# Altium schematic sheet VHDCI_CON.SchDoc: Metlino
size 420 x 297 mm; CheckedBy: P.Kulik,T.Przywozki,W.Ruclo; Author: G.Kasprowicz; CompanyName: WUT ISE; DrawnBy: G.Kasprowicz; Organization: WUT ISE; Address1: PW ISE; Address2: Nowowiejska 15/19 00-665 Warsaw; Address3: gkasprow@gmail.com; DocumentNumber: 14; Revision: 2; SheetNumber: 14; SheetTotal: 29; ModifiedBy: -; CheckedDate: -; Title2: VHDCI connectors; DivGrp: WUT ISE; Designer: G.Kasprowicz; ModifiedDate: -; ProjectName: Sensor Box
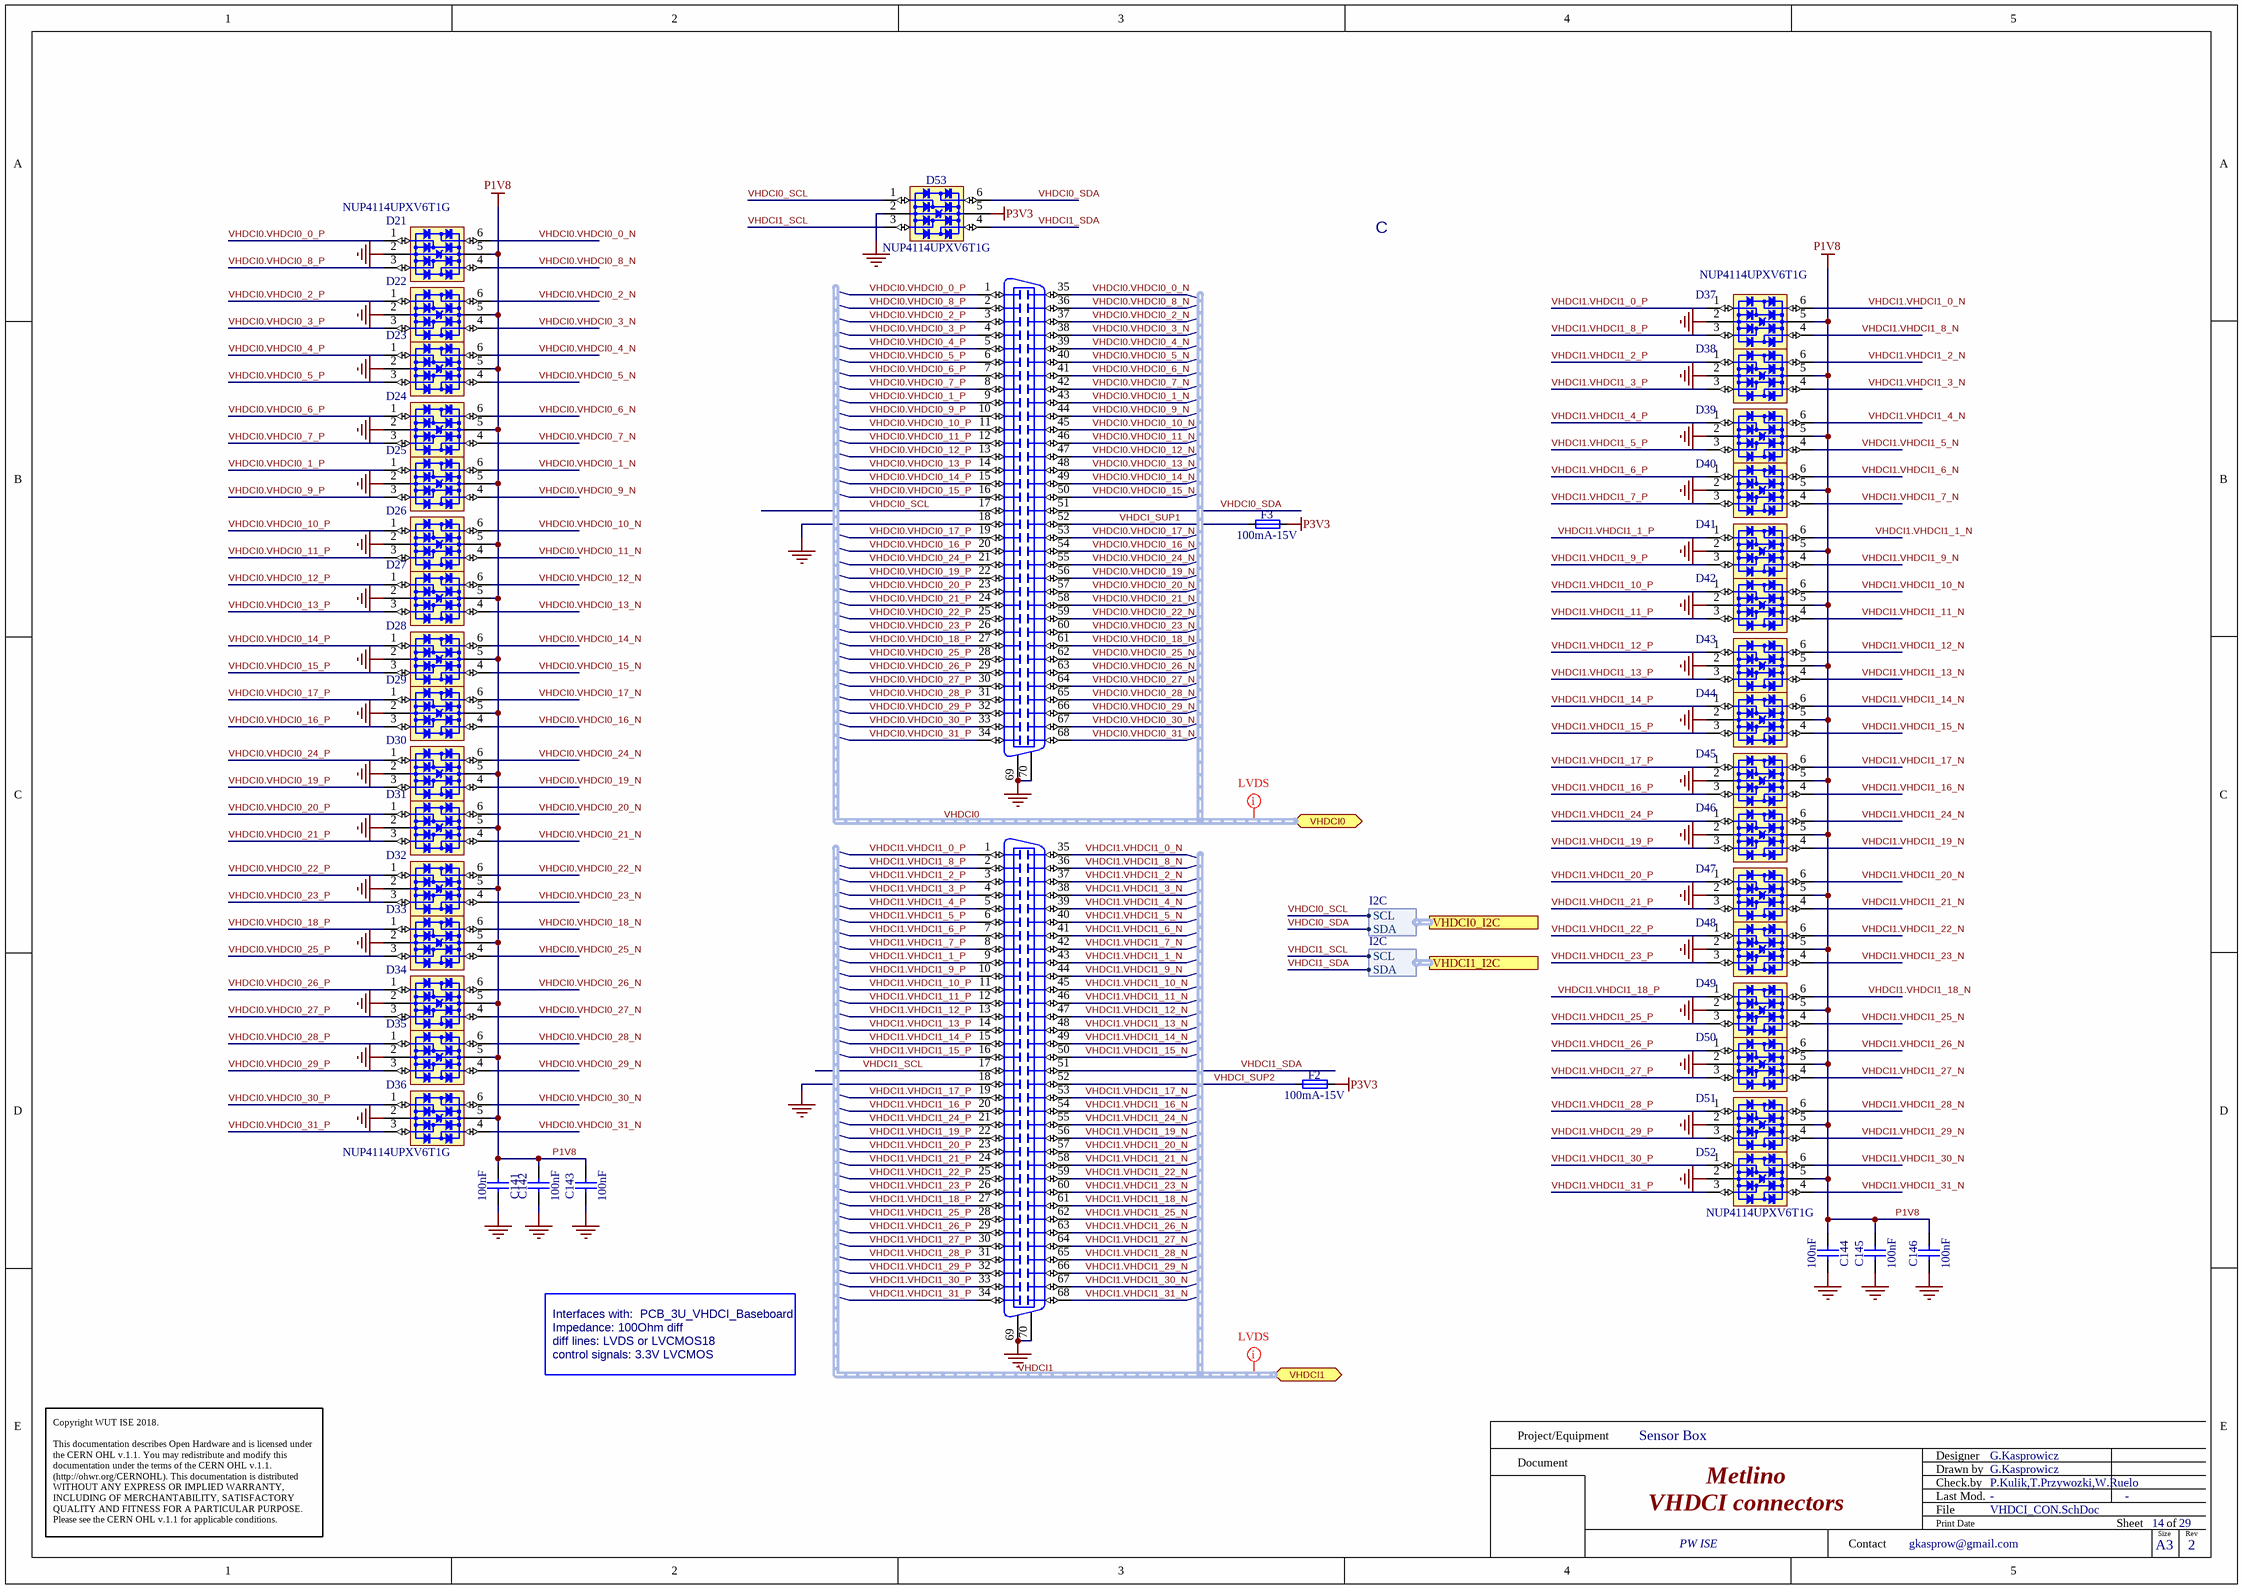
[diagram p0: VHDCI_CON.SchDoc]

## Parts
C141  100nF  [CAPC0603X33N]
C142  100nF  [CAPC0603X33N]
C143  100nF  [CAPC0603X33N]
C144  100nF  [CAPC0603X33N]
C145  100nF  [CAPC0603X33N]
C146  100nF  [CAPC0603X33N]
D21  NUP4114UPXV6T1G  [SOTFL50P160X60-6N]
D22  NUP4114UPXV6T1G  [SOTFL50P160X60-6N]  (value not drawn)
D23  NUP4114UPXV6T1G  [SOTFL50P160X60-6N]  (value not drawn)
D24  NUP4114UPXV6T1G  [SOTFL50P160X60-6N]  (value not drawn)
D25  NUP4114UPXV6T1G  [SOTFL50P160X60-6N]  (value not drawn)
D26  NUP4114UPXV6T1G  [SOTFL50P160X60-6N]  (value not drawn)
D27  NUP4114UPXV6T1G  [SOTFL50P160X60-6N]  (value not drawn)
D28  NUP4114UPXV6T1G  [SOTFL50P160X60-6N]  (value not drawn)
D29  NUP4114UPXV6T1G  [SOTFL50P160X60-6N]  (value not drawn)
D30  NUP4114UPXV6T1G  [SOTFL50P160X60-6N]  (value not drawn)
D31  NUP4114UPXV6T1G  [SOTFL50P160X60-6N]  (value not drawn)
D32  NUP4114UPXV6T1G  [SOTFL50P160X60-6N]  (value not drawn)
D33  NUP4114UPXV6T1G  [SOTFL50P160X60-6N]  (value not drawn)
D34  NUP4114UPXV6T1G  [SOTFL50P160X60-6N]  (value not drawn)
D35  NUP4114UPXV6T1G  [SOTFL50P160X60-6N]  (value not drawn)
D36  NUP4114UPXV6T1G  [SOTFL50P160X60-6N]
D37  NUP4114UPXV6T1G  [SOTFL50P160X60-6N]
D38  NUP4114UPXV6T1G  [SOTFL50P160X60-6N]  (value not drawn)
D39  NUP4114UPXV6T1G  [SOTFL50P160X60-6N]  (value not drawn)
D40  NUP4114UPXV6T1G  [SOTFL50P160X60-6N]  (value not drawn)
D41  NUP4114UPXV6T1G  [SOTFL50P160X60-6N]  (value not drawn)
D42  NUP4114UPXV6T1G  [SOTFL50P160X60-6N]  (value not drawn)
D43  NUP4114UPXV6T1G  [SOTFL50P160X60-6N]  (value not drawn)
D44  NUP4114UPXV6T1G  [SOTFL50P160X60-6N]  (value not drawn)
D45  NUP4114UPXV6T1G  [SOTFL50P160X60-6N]  (value not drawn)
D46  NUP4114UPXV6T1G  [SOTFL50P160X60-6N]  (value not drawn)
D47  NUP4114UPXV6T1G  [SOTFL50P160X60-6N]  (value not drawn)
D48  NUP4114UPXV6T1G  [SOTFL50P160X60-6N]  (value not drawn)
D49  NUP4114UPXV6T1G  [SOTFL50P160X60-6N]  (value not drawn)
D50  NUP4114UPXV6T1G  [SOTFL50P160X60-6N]  (value not drawn)
D51  NUP4114UPXV6T1G  [SOTFL50P160X60-6N]  (value not drawn)
D52  NUP4114UPXV6T1G  [SOTFL50P160X60-6N]
D53  NUP4114UPXV6T1G  [SOTFL50P160X60-6N]
F2  100mA-15V  [FUSR_LITTELFUSE_0805L010]
F3  100mA-15V  [FUSR_LITTELFUSE_0805L010]
J14  VHDCI  [MOLEX_71430-0013]  (value not drawn)
J15  VHDCI  [MOLEX_71430-0013]  (value not drawn)

## Ports
VHDCI0 (bidir, harness VHDCI0), VHDCI0_I2C (harness I2C), VHDCI1 (bidir, harness VHDCI1), VHDCI1_I2C (harness I2C)

## Harnesses
I2C: SCL, SDA

## Nets
GND: C141.1 C142.1 C143.1 C144.1 C145.1 C146.1 D21.2(GND) D22.2(GND) D23.2(GND) D24.2(GND) D25.2(GND) D26.2(GND) D27.2(GND) D28.2(GND) D29.2(GND) D30.2(GND) D31.2(GND) D32.2(GND) D33.2(GND) D34.2(GND) D35.2(GND) D36.2(GND) D37.2(GND) D38.2(GND) D39.2(GND) D40.2(GND) D41.2(GND) D42.2(GND) D43.2(GND) D44.2(GND) D45.2(GND) D46.2(GND) D47.2(GND) D48.2(GND) D49.2(GND) D50.2(GND) D51.2(GND) D52.2(GND) D53.2(GND) J14.18 J14.69 J14.70 J15.18 J15.69 J15.70
P1V8: C141.2 C142.2 C143.2 C144.2 C145.2 C146.2 D21.5(VBUS) D22.5(VBUS) D23.5(VBUS) D24.5(VBUS) D25.5(VBUS) D26.5(VBUS) D27.5(VBUS) D28.5(VBUS) D29.5(VBUS) D30.5(VBUS) D31.5(VBUS) D32.5(VBUS) D33.5(VBUS) D34.5(VBUS) D35.5(VBUS) D36.5(VBUS) D37.5(VBUS) D38.5(VBUS) D39.5(VBUS) D40.5(VBUS) D41.5(VBUS) D42.5(VBUS) D43.5(VBUS) D44.5(VBUS) D45.5(VBUS) D46.5(VBUS) D47.5(VBUS) D48.5(VBUS) D49.5(VBUS) D50.5(VBUS) D51.5(VBUS) D52.5(VBUS)
P3V3: D53.5(VBUS) F2.2 F3.2
VHDCI0.VHDCI0_0_N: D21.6(I/O4) J14.35
VHDCI0.VHDCI0_0_P: D21.1(I/O1) J14.1
VHDCI0.VHDCI0_1_N: D25.6(I/O4) J14.43
VHDCI0.VHDCI0_1_P: D25.1(I/O1) J14.9
VHDCI0.VHDCI0_2_N: D22.6(I/O4) J14.37
VHDCI0.VHDCI0_2_P: D22.1(I/O1) J14.3
VHDCI0.VHDCI0_3_N: D22.4(I/O3) J14.38
VHDCI0.VHDCI0_3_P: D22.3(I/O2) J14.4
VHDCI0.VHDCI0_4_N: D23.6(I/O4) J14.39
VHDCI0.VHDCI0_4_P: D23.1(I/O1) J14.5
VHDCI0.VHDCI0_5_N: D23.4(I/O3) J14.40
VHDCI0.VHDCI0_5_P: D23.3(I/O2) J14.6
VHDCI0.VHDCI0_6_N: D24.6(I/O4) J14.41
VHDCI0.VHDCI0_6_P: D24.1(I/O1) J14.7
VHDCI0.VHDCI0_7_N: D24.4(I/O3) J14.42
VHDCI0.VHDCI0_7_P: D24.3(I/O2) J14.8
VHDCI0.VHDCI0_8_N: D21.4(I/O3) J14.36
VHDCI0.VHDCI0_8_P: D21.3(I/O2) J14.2
VHDCI0.VHDCI0_9_N: D25.4(I/O3) J14.44
VHDCI0.VHDCI0_9_P: D25.3(I/O2) J14.10
VHDCI0.VHDCI0_10_N: D26.6(I/O4) J14.45
VHDCI0.VHDCI0_10_P: D26.1(I/O1) J14.11
VHDCI0.VHDCI0_11_N: D26.4(I/O3) J14.46
VHDCI0.VHDCI0_11_P: D26.3(I/O2) J14.12
VHDCI0.VHDCI0_12_N: D27.6(I/O4) J14.47
VHDCI0.VHDCI0_12_P: D27.1(I/O1) J14.13
VHDCI0.VHDCI0_13_N: D27.4(I/O3) J14.48
VHDCI0.VHDCI0_13_P: D27.3(I/O2) J14.14
VHDCI0.VHDCI0_14_N: D28.6(I/O4) J14.49
VHDCI0.VHDCI0_14_P: D28.1(I/O1) J14.15
VHDCI0.VHDCI0_15_N: D28.4(I/O3) J14.50
VHDCI0.VHDCI0_15_P: D28.3(I/O2) J14.16
VHDCI0.VHDCI0_16_N: D29.4(I/O3) J14.54
VHDCI0.VHDCI0_16_P: D29.3(I/O2) J14.20
VHDCI0.VHDCI0_17_N: D29.6(I/O4) J14.53
VHDCI0.VHDCI0_17_P: D29.1(I/O1) J14.19
VHDCI0.VHDCI0_18_N: D33.6(I/O4) J14.61
VHDCI0.VHDCI0_18_P: D33.1(I/O1) J14.27
VHDCI0.VHDCI0_19_N: D30.4(I/O3) J14.56
VHDCI0.VHDCI0_19_P: D30.3(I/O2) J14.22
VHDCI0.VHDCI0_20_N: D31.6(I/O4) J14.57
VHDCI0.VHDCI0_20_P: D31.1(I/O1) J14.23
VHDCI0.VHDCI0_21_N: D31.4(I/O3) J14.58
VHDCI0.VHDCI0_21_P: D31.3(I/O2) J14.24
VHDCI0.VHDCI0_22_N: D32.6(I/O4) J14.59
VHDCI0.VHDCI0_22_P: D32.1(I/O1) J14.25
VHDCI0.VHDCI0_23_N: D32.4(I/O3) J14.60
VHDCI0.VHDCI0_23_P: D32.3(I/O2) J14.26
VHDCI0.VHDCI0_24_N: D30.6(I/O4) J14.55
VHDCI0.VHDCI0_24_P: D30.1(I/O1) J14.21
VHDCI0.VHDCI0_25_N: D33.4(I/O3) J14.62
VHDCI0.VHDCI0_25_P: D33.3(I/O2) J14.28
VHDCI0.VHDCI0_26_N: D34.6(I/O4) J14.63
VHDCI0.VHDCI0_26_P: D34.1(I/O1) J14.29
VHDCI0.VHDCI0_27_N: D34.4(I/O3) J14.64
VHDCI0.VHDCI0_27_P: D34.3(I/O2) J14.30
VHDCI0.VHDCI0_28_N: D35.6(I/O4) J14.65
VHDCI0.VHDCI0_28_P: D35.1(I/O1) J14.31
VHDCI0.VHDCI0_29_N: D35.4(I/O3) J14.66
VHDCI0.VHDCI0_29_P: D35.3(I/O2) J14.32
VHDCI0.VHDCI0_30_N: D36.6(I/O4) J14.67
VHDCI0.VHDCI0_30_P: D36.1(I/O1) J14.33
VHDCI0.VHDCI0_31_N: D36.4(I/O3) J14.68
VHDCI0.VHDCI0_31_P: D36.3(I/O2) J14.34
VHDCI0_SCL: D53.1(I/O1) J14.17 ; port VHDCI0_I2C.SCL
VHDCI0_SDA: D53.6(I/O4) J14.51 ; port VHDCI0_I2C.SDA
VHDCI1.VHDCI1_0_N: D37.6(I/O4) J15.35
VHDCI1.VHDCI1_0_P: D37.1(I/O1) J15.1
VHDCI1.VHDCI1_1_N: D41.6(I/O4) J15.43
VHDCI1.VHDCI1_1_P: D41.1(I/O1) J15.9
VHDCI1.VHDCI1_2_N: D38.6(I/O4) J15.37
VHDCI1.VHDCI1_2_P: D38.1(I/O1) J15.3
VHDCI1.VHDCI1_3_N: D38.4(I/O3) J15.38
VHDCI1.VHDCI1_3_P: D38.3(I/O2) J15.4
VHDCI1.VHDCI1_4_N: D39.6(I/O4) J15.39
VHDCI1.VHDCI1_4_P: D39.1(I/O1) J15.5
VHDCI1.VHDCI1_5_N: D39.4(I/O3) J15.40
VHDCI1.VHDCI1_5_P: D39.3(I/O2) J15.6
VHDCI1.VHDCI1_6_N: D40.6(I/O4) J15.41
VHDCI1.VHDCI1_6_P: D40.1(I/O1) J15.7
VHDCI1.VHDCI1_7_N: D40.4(I/O3) J15.42
VHDCI1.VHDCI1_7_P: D40.3(I/O2) J15.8
VHDCI1.VHDCI1_8_N: D37.4(I/O3) J15.36
VHDCI1.VHDCI1_8_P: D37.3(I/O2) J15.2
VHDCI1.VHDCI1_9_N: D41.4(I/O3) J15.44
VHDCI1.VHDCI1_9_P: D41.3(I/O2) J15.10
VHDCI1.VHDCI1_10_N: D42.6(I/O4) J15.45
VHDCI1.VHDCI1_10_P: D42.1(I/O1) J15.11
VHDCI1.VHDCI1_11_N: D42.4(I/O3) J15.46
VHDCI1.VHDCI1_11_P: D42.3(I/O2) J15.12
VHDCI1.VHDCI1_12_N: D43.6(I/O4) J15.47
VHDCI1.VHDCI1_12_P: D43.1(I/O1) J15.13
VHDCI1.VHDCI1_13_N: D43.4(I/O3) J15.48
VHDCI1.VHDCI1_13_P: D43.3(I/O2) J15.14
VHDCI1.VHDCI1_14_N: D44.6(I/O4) J15.49
VHDCI1.VHDCI1_14_P: D44.1(I/O1) J15.15
VHDCI1.VHDCI1_15_N: D44.4(I/O3) J15.50
VHDCI1.VHDCI1_15_P: D44.3(I/O2) J15.16
VHDCI1.VHDCI1_16_N: D45.4(I/O3) J15.54
VHDCI1.VHDCI1_16_P: D45.3(I/O2) J15.20
VHDCI1.VHDCI1_17_N: D45.6(I/O4) J15.53
VHDCI1.VHDCI1_17_P: D45.1(I/O1) J15.19
VHDCI1.VHDCI1_18_N: D49.6(I/O4) J15.61
VHDCI1.VHDCI1_18_P: D49.1(I/O1) J15.27
VHDCI1.VHDCI1_19_N: D46.4(I/O3) J15.56
VHDCI1.VHDCI1_19_P: D46.3(I/O2) J15.22
VHDCI1.VHDCI1_20_N: D47.6(I/O4) J15.57
VHDCI1.VHDCI1_20_P: D47.1(I/O1) J15.23
VHDCI1.VHDCI1_21_N: D47.4(I/O3) J15.58
VHDCI1.VHDCI1_21_P: D47.3(I/O2) J15.24
VHDCI1.VHDCI1_22_N: D48.6(I/O4) J15.59
VHDCI1.VHDCI1_22_P: D48.1(I/O1) J15.25
VHDCI1.VHDCI1_23_N: D48.4(I/O3) J15.60
VHDCI1.VHDCI1_23_P: D48.3(I/O2) J15.26
VHDCI1.VHDCI1_24_N: D46.6(I/O4) J15.55
VHDCI1.VHDCI1_24_P: D46.1(I/O1) J15.21
VHDCI1.VHDCI1_25_N: D49.4(I/O3) J15.62
VHDCI1.VHDCI1_25_P: D49.3(I/O2) J15.28
VHDCI1.VHDCI1_26_N: D50.6(I/O4) J15.63
VHDCI1.VHDCI1_26_P: D50.1(I/O1) J15.29
VHDCI1.VHDCI1_27_N: D50.4(I/O3) J15.64
VHDCI1.VHDCI1_27_P: D50.3(I/O2) J15.30
VHDCI1.VHDCI1_28_N: D51.6(I/O4) J15.65
VHDCI1.VHDCI1_28_P: D51.1(I/O1) J15.31
VHDCI1.VHDCI1_29_N: D51.4(I/O3) J15.66
VHDCI1.VHDCI1_29_P: D51.3(I/O2) J15.32
VHDCI1.VHDCI1_30_N: D52.6(I/O4) J15.67
VHDCI1.VHDCI1_30_P: D52.1(I/O1) J15.33
VHDCI1.VHDCI1_31_N: D52.4(I/O3) J15.68
VHDCI1.VHDCI1_31_P: D52.3(I/O2) J15.34
VHDCI1_SCL: D53.3(I/O2) J15.17 ; port VHDCI1_I2C.SCL
VHDCI1_SDA: D53.4(I/O3) J15.51 ; port VHDCI1_I2C.SDA
VHDCI_SUP1: F3.1 J14.52
VHDCI_SUP2: F2.1 J15.52

## Buses and harness runs
harness VHDCI0 = port VHDCI0
harness VHDCI1 = port VHDCI1

## Layout directives
net class LVDS: (no net found under the mark)

## Notes on the sheet
- C
- Interfaces with:
- Impedance: 100Ohm diff
- diff lines: LVDS or LVCMOS18
- PCB_3U_VHDCI_Baseboard
- control signals: 3.3V LVCMOS
- Project/Equipment
- Document
- Designer
- Drawn by
- Check.by
- Copyright WUT ISE 2018.
  This documentation describes Open Hardware and is licensed under the CERN OHL v.1.1. You may redistribute and modify this documentation under the terms of the CERN OHL v.1.1. (http://ohwr.org/CERNOHL). This documentation is distributed WITHOUT ANY EXPRESS OR IMPLIED WARRANTY, INCLUDING OF MERCHANTABILITY, SATISFACTORY QUALITY AND FITNESS FOR A PARTICULAR PURPOSE. Please see the CERN OHL v.1.1 for applicable conditions.
- Contact
- File
- Last Mod.
- Print Date
- Sheet
- Size
- A3
- of
- Rev

## Library data of the parts
C141-C146 = CC0201_100NF_6.3V_10%_X5R: Non-polarised capacitor; Manufacturer: GENERIC; Part Description: SMD Multilayer Chip Ceramic Capacitor; Manufacturer1 Part Number: 02016D104KAT2A; Tolerance: ±10%; Voltage: 6.3V; TC: X5R; Manufacturer Part Number: CC0201_100NF_6.3V_10%_X5R; Part Number: CC0201_100NF_6.3V_10%_X5R; Value: 100nF; Component Kind: Standard; Component Type: Standard; Pin Count: 2; Status: Not Recommended; Case: 0201; Mounted: Yes; Socket: No; SMD: Yes; Sense: No; Manufacturer1 Example: AVX; Manufacturer1 ComponentHeight: 0.33mm; HelpURL: \\cern.ch\dfs\Applications\Altium\Datasheets\CC0201_X5R_AVX.pdf; Author: CERN DEM JLC; CreateDate: 03.12.2007; LatestRevisionDate: 03.12.2007
D21-D53 = NUP4114UPXV6T1G: Manufacturer: ON SEMICONDUCTOR; Part Description: ESD Protection Diodes Array (8kV) with Low Clamping Voltage; Voltage: 5.5V; PressFit: No; Bonding: No; Manufacturer Part Number: NUP4114UPXV6T1G; PackageDescription: SOTFL (SOT666, SOT563,), 0.50mm, Pitch; 6 Pin, 1.20mm W X 1.60mm L X 0.60mm H Body, IPC Medium Density; Part Number: NUP4114UPXV6T1G; Component Kind: Standard; Component Type: Standard; Device: NUP4114UPXV6T1G; Pin Count: 8; Mounted: Yes; Socket: No; SMD: Yes; Sense: No; ComponentHeight: 1.75mm; HelpURL: \\cern.ch\dfs\Applications\Altium\Datasheets\NUP4114UPXV6T1G.pdf; Author: CERN DEM JLC; CreateDate: 05.12.2012; LatestRevisionDate: 05.12.2012
F2 F3 = FUSR_LITTELFUSE_0805L010YR: Fuse; Part Description: POLYFUSE® Surface Mount Resettable PTC; PressFit: No; Manufacturer Part Number: 0805L010YR; Manufacturer: LITTELFUSE; PackageDescription: Surface Mount POLY-FUSE® Resettable PTC, 0805L Series; Part Number: FUSR_LITTELFUSE_0805L010YR; Value: 100mA-15V; Component Kind: Standard; Component Type: Standard; Pin Count: 2; Family: Fuses Resettable; Mounted: Yes; Socket: No; SMD: Yes; Sense: No; ComponentHeight: 1mm; HelpURL: \\cern.ch\dfs\Applications\Altium\Datasheets\FUSR_LITTELFUSE_0805L010YR.pdf; Author: CERN DEM JLC; CreateDate: 11.09.2012; LatestRevisionDate: 11.09.2012
J14 J15 = MOLEX_71430-0013: Very High Density Cable Interconnect (VHDCI ) 68 Female; Manufacturer: MOLEX; Part Description: 68 Positions, Pitch 0.8mm, Very Hight Density Right Angle Receptacle, VHDCI Standard (Recommended PCB Thickness: 1.6mm); PressFit: No; Manufacturer Part Number: 71430-0013; Part Number: MOLEX_71430-0013; Component Kind: Standard; Component Type: Standard; Pin Count: 70; Family: VHDCI; Mounted: Yes; Socket: No; SMD: No; Sense: No; Status: None; ComponentHeight: 6.28mm; HelpURL: \\cern.ch\dfs\Applications\Altium\Datasheets\MOLEX_71430-0013.pdf; Author: CERN DEM JLC; CreateDate: 30.01.2014; LatestRevisionDate: 30.01.2014